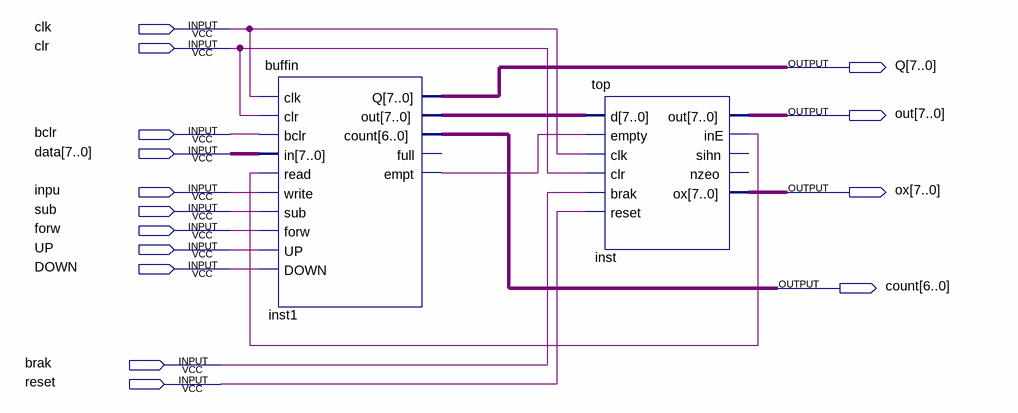
[diagram p0: schematic sheet]
// Quartus schematic myfirst.bdf as structural Verilog: 2 symbols, 15 pins
module myfirst (
  input  clk,
  input  clr,
  input  bclr,
  input  [7:0] data,
  input  inpu,
  input  sub,
  input  forw,
  input  UP,
  input  DOWN,
  input  brak,
  input  reset,
  output [7:0] Q,
  output [7:0] out,
  output [7:0] ox,
  output [6:0] count
);

  wire inst1_empt, inst_ine;
  wire [7:0] inst1_out;

  buffin inst1 (
    .clk(clk), .clr(clr), .bclr(bclr), .in(data), .read(inst_ine), .write(inpu), .sub(sub), .forw(forw),
    .UP(UP), .DOWN(DOWN), .Q(Q), .out(inst1_out), .count(count), .empt(inst1_empt));  // open: full
  top inst (
    .d(inst1_out), .empty(inst1_empt), .clk(clk), .clr(clr), .brak(brak), .reset(reset), .out(out),
    .inE(inst_ine), .ox(ox));  // open: sihn, nzeo
endmodule
